# Altium schematic sheet inertial-gy91.SchDoc
size A4
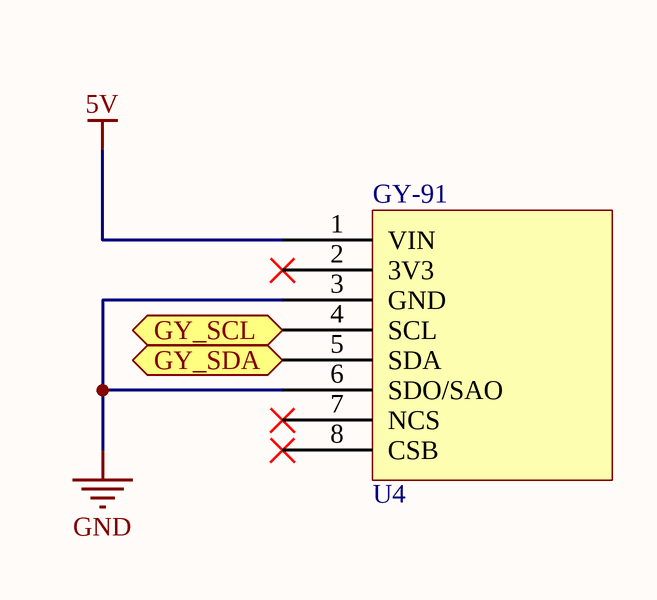
[diagram p0: inertial-gy91.SchDoc]

## Parts
U4  GY-91  [GY-91]

## Ports
GY_SCL (bidir), GY_SDA (bidir)

## Nets
5V: U4.1(VIN)
GND: U4.3(GND) U4.6(SDO/SAO)
GY_SCL: U4.4(SCL) ; port GY_SCL
GY_SDA: U4.5(SDA) ; port GY_SDA

Not connected (* = marked no-connect by the designer): U4 2(3V3)* 7(NCS)* 8(CSB)*